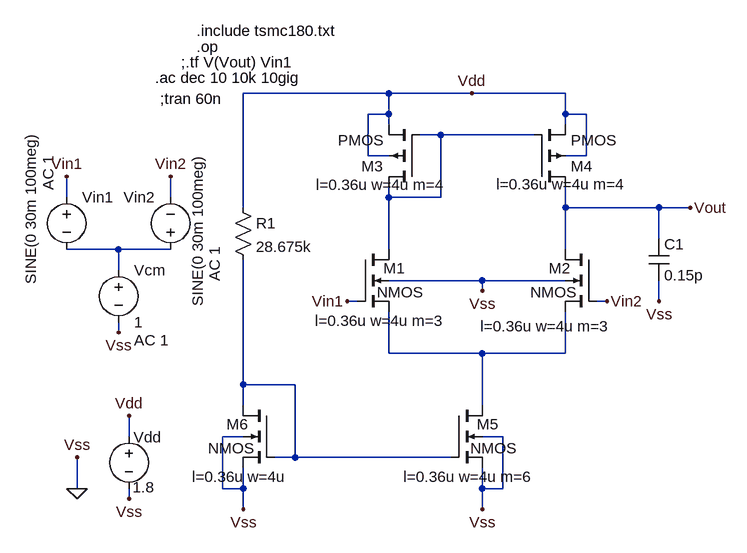
[diagram p0: schematic OP_AMP_44.asc]
OP_AMP_44.asc, the LTspice schematic file:
Version 4
SHEET 1 1576 708
WIRE 976 -16 752 -16
WIRE 1104 -16 976 -16
WIRE 1248 -16 1104 -16
WIRE 976 16 976 -16
WIRE 976 16 944 16
WIRE 1248 16 1248 -16
WIRE 1280 16 1248 16
WIRE 976 32 976 16
WIRE 1248 32 1248 16
WIRE 1056 48 1024 48
WIRE 1200 48 1056 48
WIRE 944 80 944 16
WIRE 976 80 944 80
WIRE 1280 80 1280 16
WIRE 1280 80 1248 80
WIRE 480 144 480 112
WIRE 640 144 640 112
WIRE 976 144 976 128
WIRE 1056 144 1056 48
WIRE 1056 144 976 144
WIRE 752 160 752 -16
WIRE 1248 160 1248 128
WIRE 1392 160 1248 160
WIRE 1440 160 1392 160
WIRE 1392 208 1392 160
WIRE 560 224 480 224
WIRE 640 224 560 224
WIRE 976 224 976 144
WIRE 1248 224 1248 160
WIRE 560 256 560 224
WIRE 1120 272 976 272
WIRE 1248 272 1120 272
WIRE 1120 288 1120 272
WIRE 928 304 912 304
WIRE 1312 304 1296 304
WIRE 1392 304 1392 272
WIRE 560 352 560 336
WIRE 976 384 976 320
WIRE 1120 384 976 384
WIRE 1248 384 1248 320
WIRE 1248 384 1120 384
WIRE 752 432 752 240
WIRE 832 432 752 432
WIRE 752 464 752 432
WIRE 1120 464 1120 384
WIRE 576 512 576 480
WIRE 752 512 720 512
WIRE 1152 512 1120 512
WIRE 832 544 832 432
WIRE 832 544 800 544
WIRE 1072 544 832 544
WIRE 496 592 496 544
WIRE 720 592 720 512
WIRE 752 592 752 560
WIRE 752 592 720 592
WIRE 1120 592 1120 560
WIRE 1152 592 1152 512
WIRE 1152 592 1120 592
WIRE 576 608 576 592
WIRE 752 624 752 592
WIRE 1120 624 1120 592
FLAG 496 592 0
FLAG 496 544 Vss
FLAG 576 608 Vss
FLAG 560 352 Vss
FLAG 576 480 Vdd
FLAG 912 304 Vin1
FLAG 1104 -16 Vdd
FLAG 1312 304 Vin2
FLAG 1120 288 Vss
FLAG 480 112 Vin1
FLAG 640 112 Vin2
FLAG 1392 304 Vss
FLAG 1440 160 Vout
FLAG 1120 624 Vss
FLAG 752 624 Vss
SYMBOL nmos4 928 224 R0
WINDOW 0 40 29 Left 2
WINDOW 3 30 66 Left 2
WINDOW 123 135 110 Right 2
SYMATTR InstName M1
SYMATTR Value2 l=0.36u w=4u m=3
SYMBOL voltage 576 496 R0
WINDOW 123 0 0 Left 0
WINDOW 39 0 0 Left 0
WINDOW 0 7 17 Left 2
WINDOW 3 6 94 Left 2
SYMATTR InstName Vdd
SYMATTR Value 1.8
SYMBOL nmos4 1296 224 M0
WINDOW 0 40 29 Left 2
WINDOW 3 30 66 Left 2
WINDOW 123 -21 118 Left 2
SYMATTR InstName M2
SYMATTR Value2 l=0.36u w=4u m=3
SYMBOL voltage 560 240 R0
WINDOW 123 24 124 Left 2
WINDOW 39 0 0 Left 0
SYMATTR Value2 AC 1
SYMATTR InstName Vcm
SYMATTR Value 1
SYMBOL voltage 480 128 R0
WINDOW 3 -55 -84 VRight 2
WINDOW 123 -28 -48 VRight 2
WINDOW 39 0 0 Left 0
SYMATTR Value SINE(0 30m 100meg)
SYMATTR Value2 AC 1
SYMATTR InstName Vin1
SYMBOL voltage 640 240 R180
WINDOW 0 24 96 Left 2
WINDOW 3 -42 -72 VRight 2
WINDOW 123 -68 -33 VRight 2
WINDOW 39 0 0 Left 0
SYMATTR InstName Vin2
SYMATTR Value SINE(0 30m 100meg)
SYMATTR Value2 AC 1
SYMBOL pmos4 1024 128 R180
WINDOW 123 -40 3 Left 2
SYMATTR Value2 l=0.36u w=4u m=4
SYMATTR InstName M3
SYMBOL pmos4 1200 128 M180
WINDOW 123 -58 4 Left 2
SYMATTR Value2 l=0.36u w=4u m=4
SYMATTR InstName M4
SYMBOL cap 1376 208 R0
SYMATTR InstName C1
SYMATTR Value 0.15p
SYMBOL nmos4 1072 464 R0
WINDOW 0 40 29 Left 2
WINDOW 3 30 66 Left 2
WINDOW 123 127 110 Right 2
SYMATTR InstName M5
SYMATTR Value2 l=0.36u w=4u m=6
SYMBOL nmos4 800 464 M0
WINDOW 0 40 29 Left 2
WINDOW 3 30 66 Left 2
WINDOW 123 127 110 Right 2
SYMATTR InstName M6
SYMATTR Value2 l=0.36u w=4u
SYMBOL res 736 144 R0
SYMATTR InstName R1
SYMATTR Value 28.675k
TEXT 680 -112 Left 2 !.include tsmc180.txt
TEXT 680 -88 Left 2 !.op
TEXT 656 -64 Left 2 !;.tf V(Vout) Vin1
TEXT 616 -40 Left 2 !.ac dec 10 10k 10gig
TEXT 624 -8 Left 2 !;tran 60n

The netlist it stands for:
* OP_AMP_44.asc
M1 N001 Vin1 N003 0 NMOS l=0.36u w=4u m=3
Vdd Vdd 0 1.8
M2 Vout Vin2 N003 0 NMOS l=0.36u w=4u m=3
Vcm N002 0 1 AC 1
Vin1 Vin1 N002 SINE(0 30m 100meg) AC 1
Vin2 N002 Vin2 SINE(0 30m 100meg) AC 1
M3 N001 N001 Vdd Vdd PMOS l=0.36u w=4u m=4
M4 Vout N001 Vdd Vdd PMOS l=0.36u w=4u m=4
C1 Vout 0 0.15p
M5 N003 N004 0 0 NMOS l=0.36u w=4u m=6
M6 N004 N004 0 0 NMOS l=0.36u w=4u
R1 Vdd N004 28.675k
.model NMOS NMOS
.model PMOS PMOS
.lib standard.mos
.include tsmc180.txt
.op
;.tf V(Vout) Vin1
.ac dec 10 10k 10gig
;tran 60n
.backanno
.end